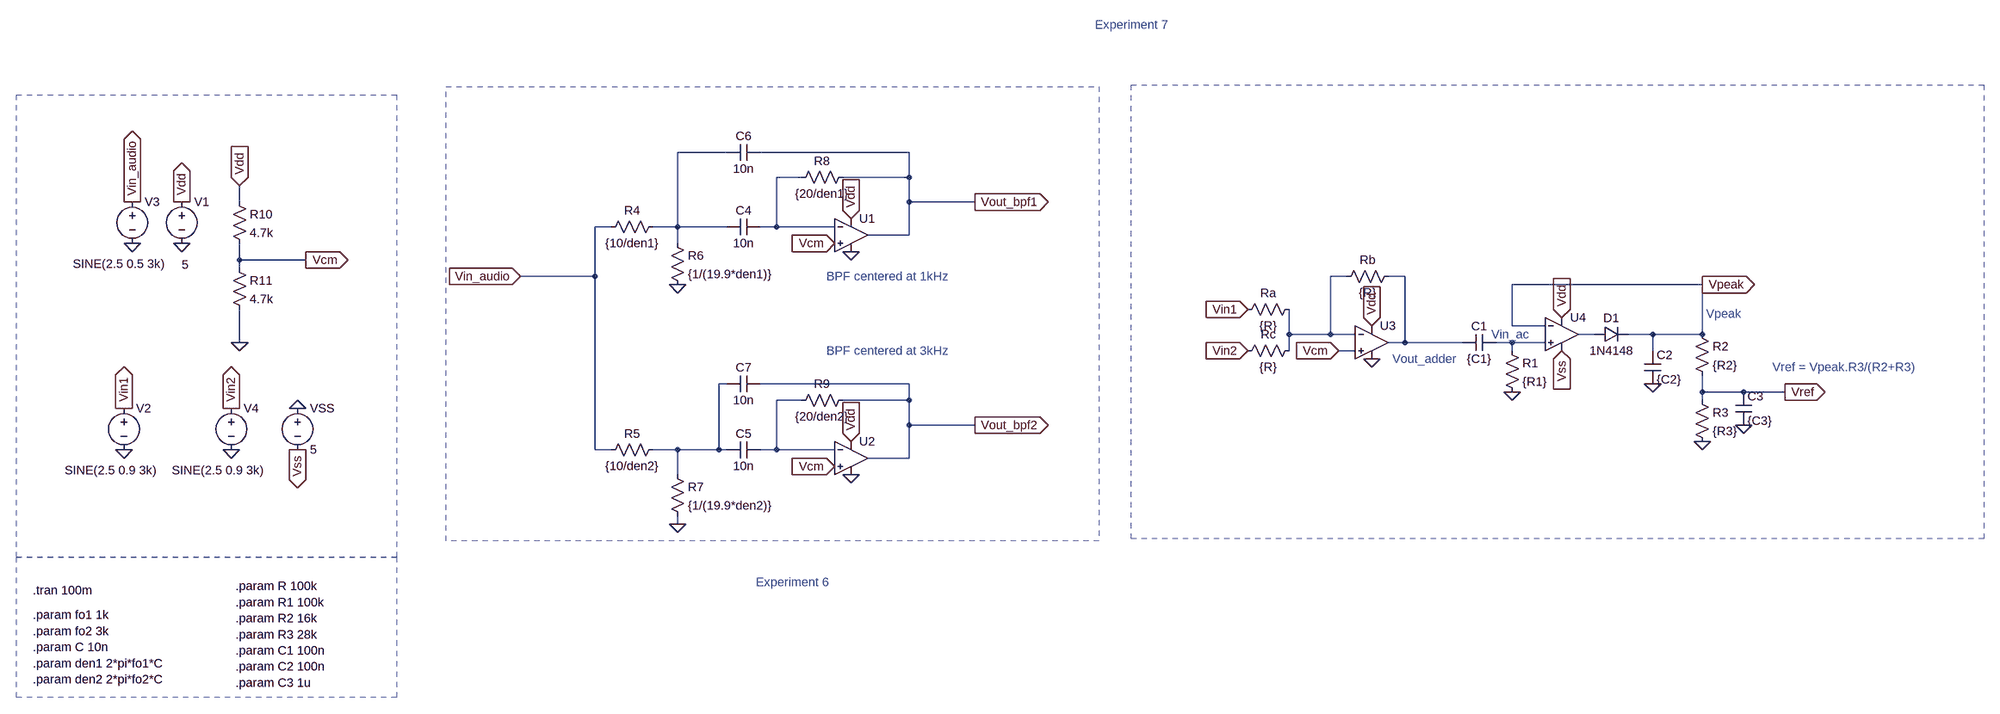
[diagram p0: schematic Ex 7.asc]
Ex 7.asc, the LTspice schematic file:
Version 4
SHEET 1 1380 680
WIRE -1376 -496 -1472 -496
WIRE -1024 -496 -1312 -496
WIRE -1232 -448 -1280 -448
WIRE -1024 -448 -1024 -496
WIRE -1024 -448 -1152 -448
WIRE -2320 -400 -2320 -432
WIRE -1024 -400 -1024 -448
WIRE -896 -400 -1024 -400
WIRE -1600 -352 -1632 -352
WIRE -1472 -352 -1472 -496
WIRE -1472 -352 -1520 -352
WIRE -1376 -352 -1472 -352
WIRE -1280 -352 -1280 -448
WIRE -1280 -352 -1312 -352
WIRE -1168 -352 -1280 -352
WIRE -1024 -336 -1024 -400
WIRE -1024 -336 -1104 -336
WIRE -1472 -320 -1472 -352
WIRE -2320 -288 -2320 -320
WIRE -2192 -288 -2320 -288
WIRE -2320 -272 -2320 -288
WIRE -1632 -256 -1632 -352
WIRE -1632 -256 -1776 -256
WIRE -176 -256 -208 -256
WIRE -64 -256 -96 -256
WIRE 512 -240 144 -240
WIRE 144 -160 144 -240
WIRE 208 -160 144 -160
WIRE -288 -144 -288 -192
WIRE -208 -144 -208 -256
WIRE -208 -144 -288 -144
WIRE -160 -144 -208 -144
WIRE 304 -144 272 -144
WIRE 416 -144 368 -144
WIRE 512 -144 512 -240
WIRE 512 -144 416 -144
WIRE -2320 -128 -2320 -192
WIRE -64 -128 -64 -256
WIRE -64 -128 -96 -128
WIRE 48 -128 -64 -128
WIRE 144 -128 112 -128
WIRE 208 -128 144 -128
WIRE -288 -112 -288 -144
WIRE -160 -112 -192 -112
WIRE 144 -112 144 -128
WIRE 416 -112 416 -144
WIRE -1376 -48 -1392 -48
WIRE -1024 -48 -1312 -48
WIRE 512 -32 512 -64
WIRE 592 -32 512 -32
WIRE 672 -32 592 -32
WIRE -1232 -16 -1280 -16
WIRE -1024 -16 -1024 -48
WIRE -1024 -16 -1152 -16
WIRE 512 -16 512 -32
WIRE -1024 32 -1024 -16
WIRE -896 32 -1024 32
WIRE -1632 80 -1632 -256
WIRE -1600 80 -1632 80
WIRE -1472 80 -1520 80
WIRE -1392 80 -1392 -48
WIRE -1392 80 -1472 80
WIRE -1376 80 -1392 80
WIRE -1280 80 -1280 -16
WIRE -1280 80 -1312 80
WIRE -1168 80 -1280 80
WIRE -1024 96 -1024 32
WIRE -1024 96 -1104 96
WIRE -1472 128 -1472 80
WIRE -1472 224 -1472 208
FLAG -192 -112 Vcm
IOPIN -192 -112 In
FLAG -368 -192 Vin1
IOPIN -368 -192 In
FLAG -368 -112 Vin2
IOPIN -368 -112 In
FLAG 144 -32 0
FLAG 416 -48 0
FLAG 512 64 0
FLAG 592 32 0
FLAG -128 -96 0
FLAG -128 -160 Vdd
IOPIN -128 -160 In
FLAG 240 -176 Vdd
IOPIN 240 -176 In
FLAG -1136 -368 Vdd
IOPIN -1136 -368 In
FLAG -1136 64 Vdd
IOPIN -1136 64 In
FLAG -1136 -304 0
FLAG -1136 128 0
FLAG -1168 -320 Vcm
IOPIN -1168 -320 In
FLAG -1168 112 Vcm
IOPIN -1168 112 In
FLAG -1472 -240 0
FLAG -1472 224 0
FLAG -1776 -256 Vin_audio
IOPIN -1776 -256 In
FLAG -896 -400 Vout_bpf1
IOPIN -896 -400 Out
FLAG -896 32 Vout_bpf2
IOPIN -896 32 Out
FLAG -2528 -320 0
FLAG -2432 -320 0
FLAG -2528 -400 Vin_audio
IOPIN -2528 -400 Out
FLAG -2432 -400 Vdd
IOPIN -2432 -400 Out
FLAG -2320 -128 0
FLAG -2320 -432 Vdd
IOPIN -2320 -432 In
FLAG -2192 -288 Vcm
IOPIN -2192 -288 Out
FLAG -2544 80 0
FLAG -2544 0 Vin1
IOPIN -2544 0 Out
FLAG -2336 80 0
FLAG -2336 0 Vin2
IOPIN -2336 0 Out
FLAG -2208 0 0
FLAG -2208 80 Vss
IOPIN -2208 80 Out
FLAG 240 -112 Vss
IOPIN 240 -112 In
FLAG 672 -32 Vref
IOPIN 672 -32 Out
FLAG 512 -240 Vpeak
IOPIN 512 -240 Out
SYMBOL res -272 -208 R90
WINDOW 0 0 56 VBottom 2
WINDOW 3 32 56 VTop 2
SYMATTR InstName Ra
SYMATTR Value {R}
SYMBOL res -272 -128 R90
WINDOW 0 0 56 VBottom 2
WINDOW 3 32 56 VTop 2
SYMATTR InstName Rc
SYMATTR Value {R}
SYMBOL res -80 -272 R90
WINDOW 0 0 56 VBottom 2
WINDOW 3 32 56 VTop 2
SYMATTR InstName Rb
SYMATTR Value {R}
SYMBOL cap 112 -144 R90
WINDOW 0 0 32 VBottom 2
WINDOW 3 32 32 VTop 2
SYMATTR InstName C1
SYMATTR Value {C1}
SYMBOL res 128 -128 R0
SYMATTR InstName R1
SYMATTR Value {R1}
SYMBOL diode 304 -128 R270
WINDOW 0 32 32 VTop 2
WINDOW 3 0 32 VBottom 2
SYMATTR InstName D1
SYMATTR Value 1N4148
SYMBOL cap 400 -112 R0
SYMATTR InstName C2
SYMATTR Value {C2}
SYMBOL res 496 -160 R0
SYMATTR InstName R2
SYMATTR Value {R2}
SYMBOL res 496 -32 R0
SYMATTR InstName R3
SYMATTR Value {R3}
SYMBOL cap 576 -32 R0
SYMATTR InstName C3
SYMATTR Value {C3}
SYMBOL res -1504 -368 R90
WINDOW 0 0 56 VBottom 2
WINDOW 3 32 56 VTop 2
SYMATTR InstName R4
SYMATTR Value {10/den1}
SYMBOL res -1504 64 R90
WINDOW 0 0 56 VBottom 2
WINDOW 3 32 56 VTop 2
SYMATTR InstName R5
SYMATTR Value {10/den2}
SYMBOL res -1488 -336 R0
SYMATTR InstName R6
SYMATTR Value {1/(19.9*den1)}
SYMBOL res -1488 112 R0
SYMATTR InstName R7
SYMATTR Value {1/(19.9*den2)}
SYMBOL cap -1312 -368 R90
WINDOW 0 0 32 VBottom 2
WINDOW 3 32 32 VTop 2
SYMATTR InstName C4
SYMATTR Value 10n
SYMBOL cap -1312 64 R90
WINDOW 0 0 32 VBottom 2
WINDOW 3 32 32 VTop 2
SYMATTR InstName C5
SYMATTR Value 10n
SYMBOL res -1136 -464 R90
WINDOW 0 0 56 VBottom 2
WINDOW 3 32 56 VTop 2
SYMATTR InstName R8
SYMATTR Value {20/den1}
SYMBOL res -1136 -32 R90
WINDOW 0 0 56 VBottom 2
WINDOW 3 32 56 VTop 2
SYMATTR InstName R9
SYMATTR Value {20/den2}
SYMBOL cap -1312 -512 R90
WINDOW 0 0 32 VBottom 2
WINDOW 3 32 32 VTop 2
SYMATTR InstName C6
SYMATTR Value 10n
SYMBOL cap -1312 -64 R90
WINDOW 0 0 32 VBottom 2
WINDOW 3 32 32 VTop 2
SYMATTR InstName C7
SYMATTR Value 10n
SYMBOL OpAmps\\UniversalOpamp2 -1136 -336 R0
SYMATTR InstName U1
SYMBOL OpAmps\\UniversalOpamp2 -1136 96 R0
SYMATTR InstName U2
SYMBOL voltage -2432 -416 R0
WINDOW 3 0 137 Left 2
SYMATTR Value 5
SYMATTR InstName V1
SYMBOL voltage -2528 -416 R0
WINDOW 123 0 0 Left 0
WINDOW 39 0 0 Left 0
WINDOW 3 -115 136 Left 2
SYMATTR Value SINE(2.5 0.5 3k)
SYMATTR InstName V3
SYMBOL res -2336 -416 R0
SYMATTR InstName R10
SYMATTR Value 4.7k
SYMBOL res -2336 -288 R0
SYMATTR InstName R11
SYMATTR Value 4.7k
SYMBOL voltage -2544 -16 R0
WINDOW 123 0 0 Left 0
WINDOW 39 0 0 Left 0
WINDOW 3 -115 136 Left 2
SYMATTR Value SINE(2.5 0.9 3k)
SYMATTR InstName V2
SYMBOL voltage -2336 -16 R0
WINDOW 123 0 0 Left 0
WINDOW 39 0 0 Left 0
WINDOW 3 -115 136 Left 2
SYMATTR Value SINE(2.5 0.9 3k)
SYMATTR InstName V4
SYMBOL voltage -2208 -16 R0
SYMATTR InstName VSS
SYMATTR Value 5
SYMBOL OpAmps\\UniversalOpamp2 -128 -128 R0
SYMATTR InstName U3
SYMBOL OpAmps\\UniversalOpamp2 240 -144 R0
SYMATTR InstName U4
TEXT -88 -96 Left 2 ;Vout_adder
TEXT 520 -184 Left 2 ;Vpeak
TEXT 648 -80 Left 2 ;Vref = Vpeak.R3/(R2+R3)
TEXT -2328 344 Left 2 !.param R 100k\n.param R1 100k\n.param R2 16k\n.param R3 28k\n.param C1 100n\n.param C2 100n\n.param C3 1u
TEXT -664 -864 Left 2 ;Experiment 7
TEXT -2720 400 Left 2 !.param fo1 1k\n.param fo2 3k\n.param C 10n\n.param den1 2*pi*fo1*C\n.param den2 2*pi*fo2*C
TEXT -2720 352 Left 2 !.tran 100m
TEXT -1320 336 Left 2 ;Experiment 6
TEXT -1184 -256 Left 2 ;BPF centered at 1kHz
TEXT -1184 -112 Left 2 ;BPF centered at 3kHz
TEXT 104 -144 Left 2 ;Vin_ac
RECTANGLE Normal -2016 288 -2752 -608 2
RECTANGLE Normal -2016 560 -2752 288 2
RECTANGLE Normal -656 256 -1920 -624 2
RECTANGLE Normal 1057 252 -594 -627 2

The netlist it stands for:
* Ex 7.asc
Ra N003 Vin1 {R}
Rc N003 Vin2 {R}
Rb N004 N003 {R}
C1 N006 N004 {C1}
R1 N006 0 {R1}
D1 N005 Vpeak 1N4148
C2 Vpeak 0 {C2}
R2 Vpeak Vref {R2}
R3 Vref 0 {R3}
C3 Vref 0 {C3}
R4 N001 Vin_audio {10/den1}
R5 N007 Vin_audio {10/den2}
R6 N001 0 {1/(19.9*den1)}
R7 N007 0 {1/(19.9*den2)}
C4 N002 N001 10n
C5 N008 N007 10n
R8 Vout_bpf1 N002 {20/den1}
R9 Vout_bpf2 N008 {20/den2}
C6 Vout_bpf1 N001 10n
C7 Vout_bpf2 N007 10n
XU1 Vcm N002 Vdd 0 Vout_bpf1 level.2 Avol=1Meg GBW=10Meg Slew=10Meg ilimit=25m rail=0 Vos=0 phimargin=45 en=0 enk=0 in=0 ink=0 Rin=500Meg  ; pins IN+ IN- V+ V- OUT
XU2 Vcm N008 Vdd 0 Vout_bpf2 level.2 Avol=1Meg GBW=10Meg Slew=10Meg ilimit=25m rail=0 Vos=0 phimargin=45 en=0 enk=0 in=0 ink=0 Rin=500Meg  ; pins IN+ IN- V+ V- OUT
V1 Vdd 0 5
V3 Vin_audio 0 SINE(2.5 0.5 3k)
R10 Vdd Vcm 4.7k
R11 Vcm 0 4.7k
V2 Vin1 0 SINE(2.5 0.9 3k)
V4 Vin2 0 SINE(2.5 0.9 3k)
VSS 0 Vss 5
XU3 Vcm N003 Vdd 0 N004 level.2 Avol=1Meg GBW=10Meg Slew=10Meg ilimit=25m rail=0 Vos=0 phimargin=45 en=0 enk=0 in=0 ink=0 Rin=500Meg  ; pins IN+ IN- V+ V- OUT
XU4 N006 Vpeak Vdd Vss N005 level.2 Avol=1Meg GBW=10Meg Slew=10Meg ilimit=25m rail=0 Vos=0 phimargin=45 en=0 enk=0 in=0 ink=0 Rin=500Meg  ; pins IN+ IN- V+ V- OUT
.model D D
.lib standard.dio
* Vout_adder
* Vpeak
* Vref = Vpeak.R3/(R2+R3)
.param R 100k
.param R1 100k
.param R2 16k
.param R3 28k
.param C1 100n
.param C2 100n
.param C3 1u
* Experiment 7
.param fo1 1k
.param fo2 3k
.param C 10n
.param den1 2*pi*fo1*C
.param den2 2*pi*fo2*C
.tran 100m
* Experiment 6
* BPF centered at 1kHz
* BPF centered at 3kHz
* Vin_ac
.lib UniversalOpamps2.sub
.backanno
.end